# EAGLE design esp8266S_6A (EAGLE 7.5.0)
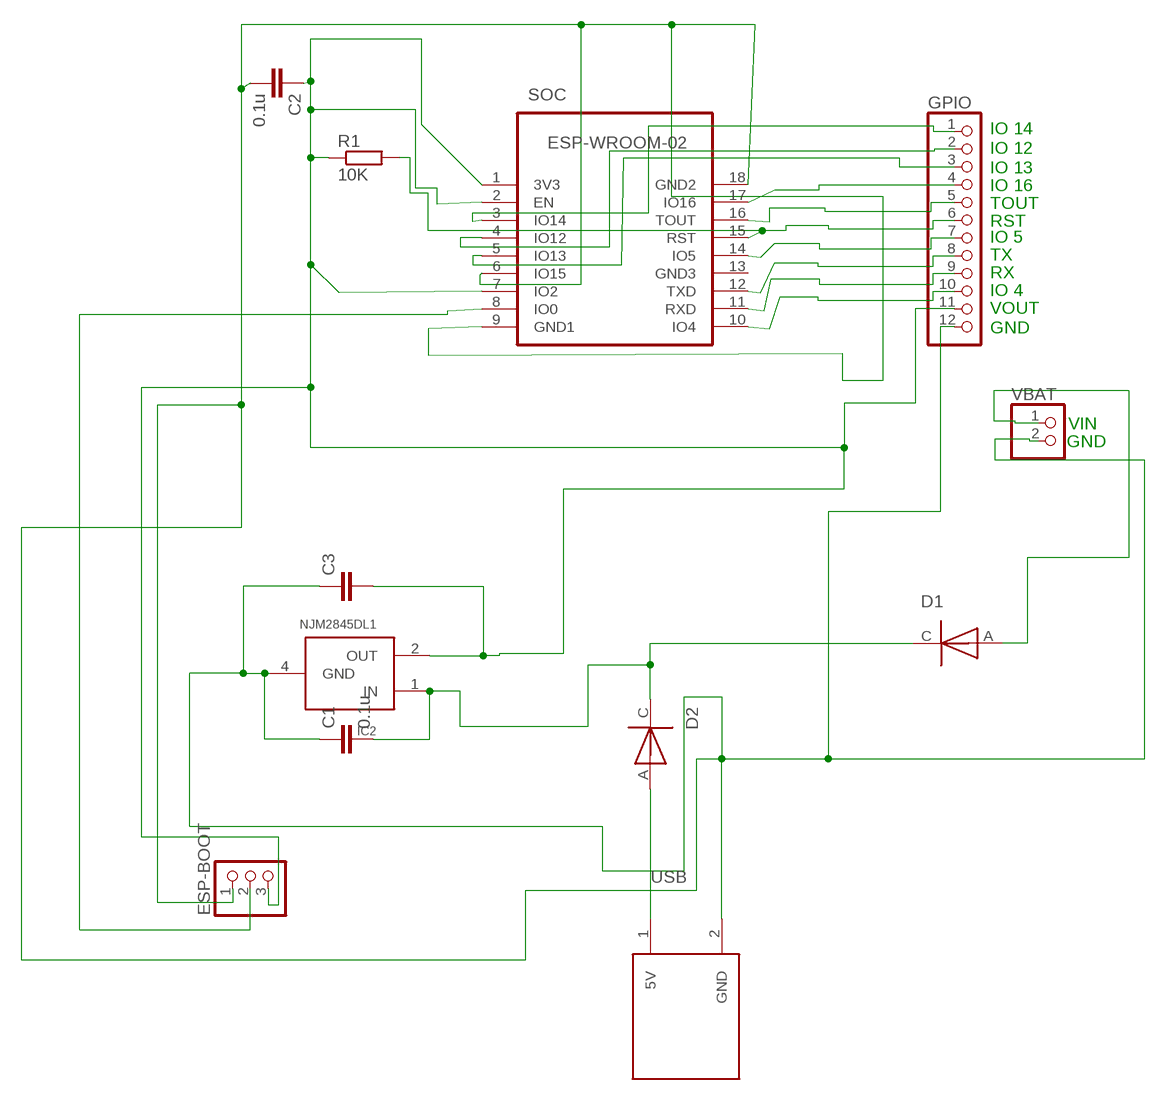
[diagram p0: schematic, sheet 1]

## Parts
C1  0.1u  C-EUC0603  [C0603]
C2  0.1u  C-EUC0603  [C0603]
C3  C-EUC1206  [C1206]
D1  DIODE-EX  [SOD80C]
D2  DIODE-EX  [SOD80C]
ESP-BOOT  PINHD-1X3  [1X03]
GPIO  PINHD-1X12  [1X12]
IC2  NJM2845DL1  [NJM2845DL1-PKG]
R1  10K  R-EU_R0603  [R0603]
SOC  ESP-WROOM-02  ESP-WROOM-02-CP2FRONT  [FRONT-FACE-CP2]
USB  USB-CUST-1  [USB-CUST-1-PKG]
VBAT  PINHD-1X2  [1X02]

## Nets
N$1: ESP-BOOT.2 SOC.8(IO0)
N$4: GPIO.1 SOC.3(IO14)
N$5: C1.2 D1.C D2.C IC2.1(IN)
N$6: GPIO.4 SOC.17(IO16)
N$7: GPIO.5 SOC.16(TOUT)
N$8: GPIO.7 SOC.14(IO5)
N$9: GPIO.8 SOC.12(TXD)
N$10: GPIO.9 SOC.11(RXD)
N$11: GPIO.10 SOC.10(IO4)
N$12: D2.A USB.1(5V)
N$13: GPIO.6 R1.2 SOC.15(RST)
N$14: C2.1 C3.2 ESP-BOOT.3 GPIO.11 IC2.2(OUT) R1.1 SOC.1(3V3) SOC.2(EN) SOC.7(IO2)
N$15: D1.A VBAT.1
N$16: GPIO.3 SOC.5(IO13)
N$17: GPIO.2 SOC.4(IO12)
N$19: C1.1 C2.2 C3.1 ESP-BOOT.1 GPIO.12 IC2.4(GND) SOC.6(IO15) SOC.9(GND1) SOC.18(GND2) USB.2(GND) VBAT.2
Unconnected: SOC.13(GND3)

## Notes on the sheet
- IO 14
- IO 12
- IO 13
- IO 16
- TOUT
- RST
- IO 5
- TX
- RX
- IO 4
- VOUT
- GND
- VIN
- GND

## Library data of the parts
C1-C3 = resistor:C-EU: CAPACITOR, European symbol
D1 D2 = diode-ex2:DIODE-EX
ESP-BOOT = pinhead:PINHD-1X3: PIN HEADER
GPIO = pinhead:PINHD-1X12: PIN HEADER
IC2 = ic-cust-4:NJM2845DL1
R1 = resistor:R-EU_: RESISTOR, European symbol
SOC = esp-wroom-02-CP2:ESP-WROOM-02-CP2: WiFi module - ESP-WROOM-02
USB = usb-cust-2:USB-CUST-1
VBAT = pinhead:PINHD-1X2: PIN HEADER

## Board
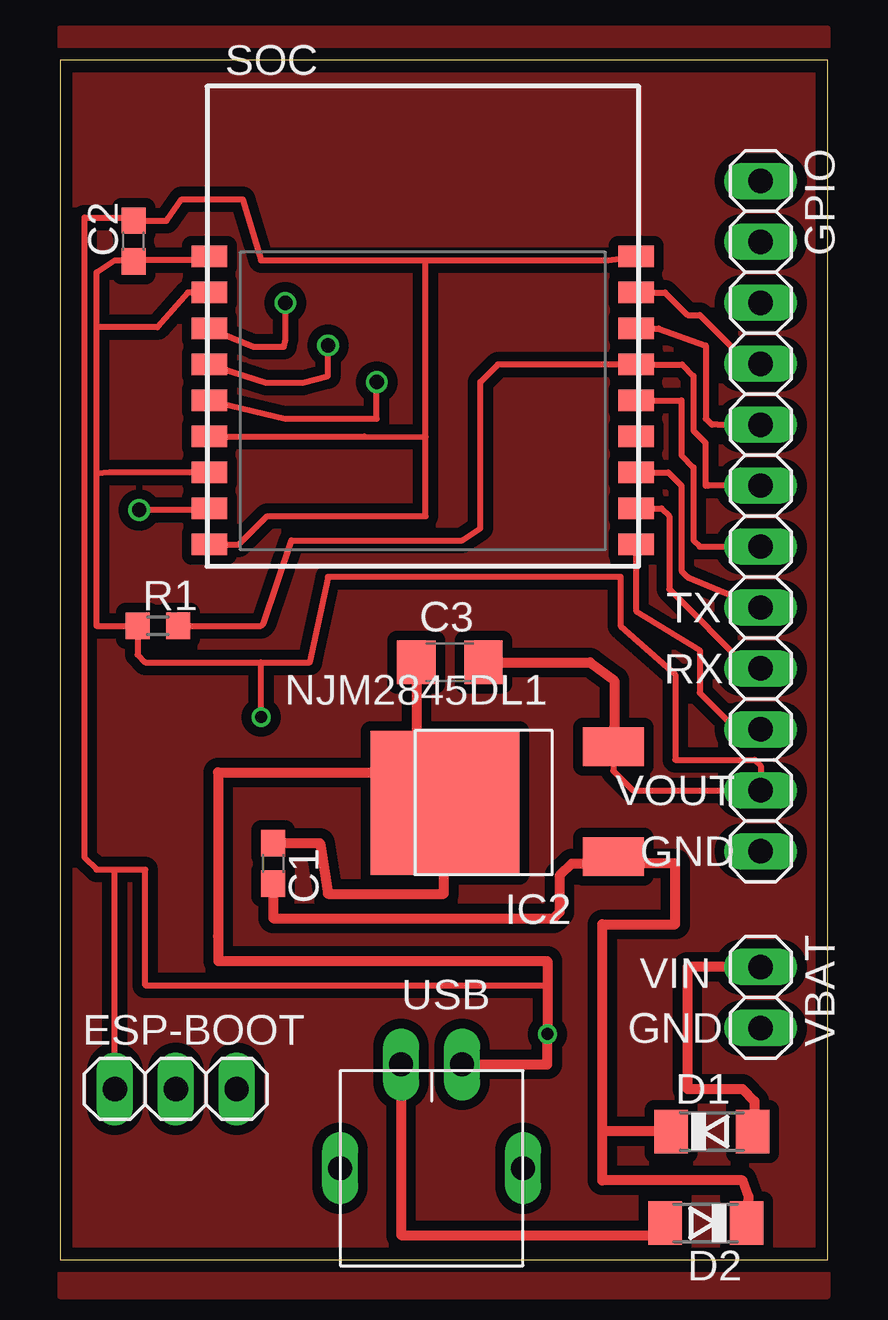
[diagram p1: board, top side]
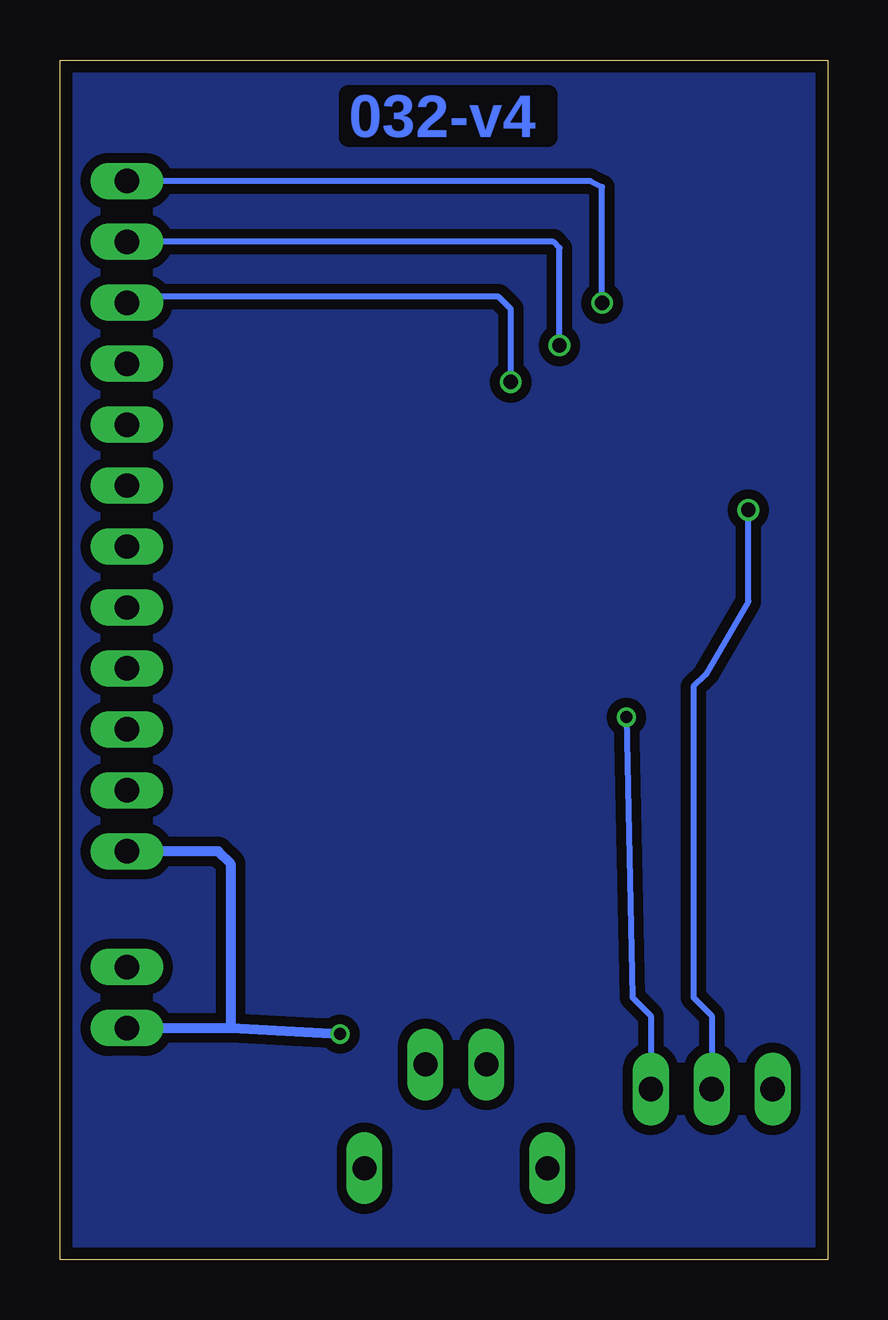
[diagram p2: board, bottom side, seen from below]

Size 32 x 50 mm. Coordinates in mm from the lower left corner, seen from the top.
Outline: 0,0 32,0 32,50 0,50 0,0
Copper layers (1*16): Top 0.035mm / dielectric 1.6mm / Bottom 0.035mm
Design rules "Elecrow_2-layer_PCB_eagle_rule": minimum track width 6mil, minimum drill 12mil, track to track 6mil, track to pad 6mil, pad to pad 6mil, via to via 8mil, smd to smd 0mil, copper to edge 20mil, drill to drill 10mil, minimum pad ring 6mil, minimum via ring 6mil, stop-mask expansion 0mil, vias tented up to drill 100mil, thermal gap 10mil

### Footprints (pad centres in the part's own frame; a part is rotated, then mirrored left to right if it is on the bottom)
C0603 = smd 1.1 x 1: 1 -0.85,0; 2 0.85,0
C1206 = smd 1.6 x 1.8: 1 -1.4,0; 2 1.4,0
SOD80C = smd 1.4 x 1.8: A 1.7,0; C -1.7,0
1X03 = drill 1.016 long: 1 -2.54,0; 2 0,0; 3 2.54,0
1X12 = drill 1.016 long: 1 -13.97,0; 2 -11.43,0; 3 -8.89,0; 4 -6.35,0; 5 -3.81,0; 6 -1.27,0; 7 1.27,0; 8 3.81,0; 9 6.35,0; 10 8.89,0; 11 11.43,0; 12 13.97,0
NJM2845DL1-PKG = smd 2.54 x 1.6: 1 -4.27,2.254; 2 -4.27,-2.318 | smd 6.2 x 6: 4 2.746,0.016
R0603 = smd 1 x 1.1: 1 -0.85,0; 2 0.85,0
FRONT-FACE-CP2 = smd 1.485 x 0.9: 1 -8.893,4.9; 2 -8.893,3.4; 3 -8.893,1.9; 4 -8.893,0.4; 5 -8.893,-1.1; 6 -8.893,-2.6; 7 -8.893,-4.1; 8 -8.893,-5.6; 9 -8.893,-7.1; 10 8.893,-7.1; 11 8.893,-5.6; 12 8.893,-4.1; 13 8.893,-2.6; 14 8.893,-1.1; 15 8.893,0.4; 16 8.893,1.9; 17 8.893,3.4; 18 8.893,4.9
USB-CUST-1-PKG = drill 1 long: 1 -1.27,6.604; 2 1.27,6.604; 3 -3.81,2.286; 4 3.81,2.286
1X02 = drill 1.016 long: 1 -1.27,0; 2 1.27,0

### Placement (x,y rotation side)
C1  8.89,16.51 270 top
C2  3.06,42.45 90 top
C3  16.26,24.89 0 top
D1  27.18,5.33 0 top
D2  26.92,1.52 180 top
ESP-BOOT  4.83,7.11 0 top
GPIO  29.21,30.99 270 top
IC2  18.8,19.05 180 top
R1  4.08,26.42 0 top
SOC  15.13,36.91 0 top
USB  15.49,1.52 0 top
VBAT  29.21,10.92 270 top

### Tracks (layer width: path | path; a pad name or v marks a point on that pad's centre or on a via)
N$1  (via drill 0.6)
  Top 0.254: SOC.8 6.17,31.24 v3.3,31.24
  Bottom 0.254: v3.3,31.24 3.3,27.43 5.08,24.38 5.59,23.88 5.59,10.92 4.83,10.16 ESP-BOOT.2
N$2
  pour Bottom (isolate 0.406, no thermals): 0,50 0,0 32,0 32,50
N$4  (via drill 0.6)
  Top 0.254: SOC.3 8.07,38.04 9.34,38.04 9.4,38.35 v9.4,39.88
  Bottom 0.254: v9.4,39.88 9.4,44.7 9.91,44.96 GPIO.1
N$5
  Top 0.406: 22.61,5.33 22.61,3.3 28.45,3.3 28.7,2.62 D2.C | 22.61,5.33 22.61,13.97 25.65,13.97 25.65,16.51 23.07,16.51 IC2.1 23.03,16.51 21.34,16.51 20.83,16 20.83,14.48 20.57,14.22 8.89,14.22 C1.2 | D1.C 22.61,5.33
N$6
  Top 0.254: SOC.17 25.23,40.31 26.16,39.37 26.67,39.37 28.7,37.34 GPIO.4
N$7
  Top 0.254: SOC.16 24.95,38.81 26.92,38.1 26.92,35.05 27.18,34.8 27.43,34.8 GPIO.5 29.46,34.8
N$8
  Top 0.254: SOC.14 25.9,35.81 25.91,35.81 25.91,33.53 26.42,33.02 26.42,29.97 26.67,29.72 GPIO.7
N$9
  Top 0.254: 23.58,32.81 SOC.12 25.36,32.81 25.91,32.26 25.91,28.7 26.16,28.45 GPIO.8
N$10
  Top 0.254: SOC.11 25.08,31.31 25.4,30.99 25.4,27.94 28.7,24.64 GPIO.9
N$11
  Top 0.254: SOC.10 24.02,27.04 26.67,25.4 26.67,23.62 28.19,22.1 GPIO.10
N$12
  Top 0.406: USB.1 14.22,1.02 24.97,1.02 D2.A
N$13
  Top 0.254: GPIO.6 27.02,32.26 26.97,32.31 26.92,32.26 26.92,34.04 26.42,34.54 26.42,36.83 25.94,37.31 SOC.15 18.26,37.31 17.53,36.58 17.53,30.48 16.76,29.97 9.65,29.97 8.49,26.52 8.38,26.42 R1.2
N$14  (via drill 0.5)
  Top 0.254: SOC.1 6.08,41.66 3.12,41.66 C2.1 3.01,41.66 2.29,41.66 1.52,41.15 1.52,38.86 | 1.52,32.77 1.52,26.42 R1.1 3.23,25.22 3.56,24.89 8.38,24.89 | 1.52,32.77 1.52,38.86 | SOC.7 2.07,32.81 1.52,32.77 | SOC.2 5.33,40.31 4.06,38.86 1.52,38.86 | 8.38,24.89 10.41,24.89 11.18,28.45 23.37,28.45 23.37,26.42 25.65,24.38 25.65,20.83 28.96,20.83 29.21,20.57 GPIO.11 23.88,19.56 23.07,20.37 IC2.2 | v8.38,22.61 8.38,24.89
  Top 0.305: 23.11,22.18 IC2.2
  Top 0.406: C3.2 22.1,24.89 23.11,24.13 23.11,22.18
  Bottom 0.254: v8.38,22.61 8.13,10.92 7.37,10.16 ESP-BOOT.3
N$15
  Top 0.406: VBAT.1 26.16,12.19 26.16,7.11 28.45,7.11 28.96,6.6 28.96,5.41 D1.A
N$16  (via drill 0.6)
  Top 0.254: SOC.5 9.39,35.04 13.21,35.05 v13.21,36.58
  Bottom 0.254: v13.21,36.58 13.21,39.62 13.72,40.13 28.96,40.13 GPIO.3
N$17  (via drill 0.6)
  Top 0.254: SOC.4 8.6,36.54 10.13,36.54 11.18,36.83 v11.18,38.1
  Bottom 0.254: v11.18,38.1 11.18,42.16 11.43,42.42 GPIO.2
N$18
  pour Top (isolate 0.406, no thermals): 0,51.31 0,-1.52 32,-1.52 32,51.31
N$19  (via drill 0.5)
  Top 0.254: 15.24,41.66 8.38,41.66 7.62,44.2 5.08,44.2 4.44,43.3 C2.2 2.93,43.43 1.02,43.43 1.02,16.76 1.52,16.26 2.29,16.26 | 15.24,41.66 22.85,41.66 SOC.18 | SOC.9 7.45,29.81 8.64,30.99 15.24,30.99 15.24,34.29 | 15.24,34.29 15.24,41.66 | SOC.6 12.68,34.31 15.24,34.29 | 20.32,11.43 3.56,11.43 3.56,16.26 2.29,16.26 | ESP-BOOT.1 2.29,16.26
  Top 0.406: C1.1 10.83,17.36 11.18,15.24 16,15.24 16,17.72 IC2.4 | USB.2 20.32,8.13 v20.32,9.4 20.32,11.43 20.32,12.45 6.6,12.45 6.59,13.48 6.59,20.3 15.16,20.3 15.23,20.37 | 15.87,18.96 IC2.4 | C3.1 14.86,20.99 15.23,20.37 | 15.23,20.37 IC2.4
  Bottom 0.406: GPIO.12 25.4,17.02 24.89,16.51 24.89,9.65 | VBAT.2 24.89,9.65 | 24.89,9.65 v20.32,9.4

### Text on the board
Bottom: 032-v4
tNames: TX | RX | VOUT | GND | VIN | GND